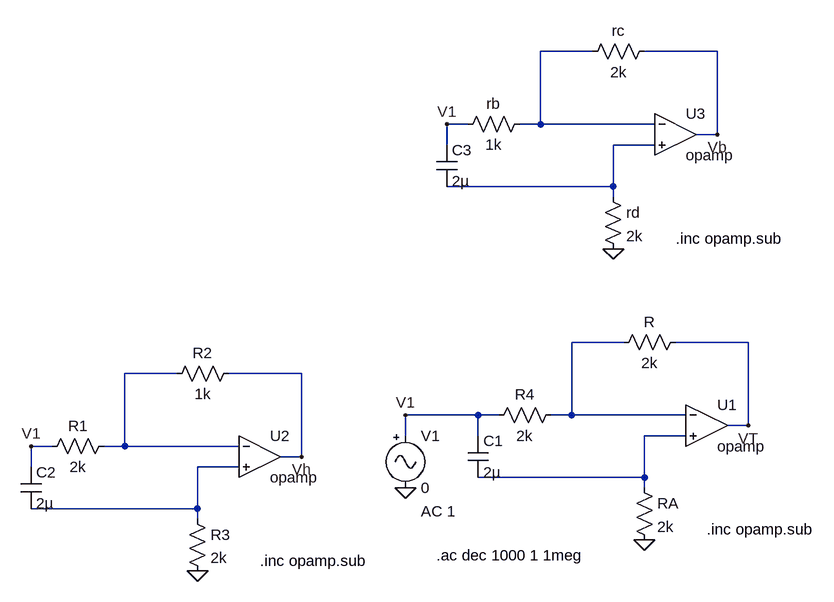
[diagram p0: schematic TS1.asc]
TS1.asc, the LTspice schematic file:
Version 4
SHEET 1 880 680
WIRE 224 -448 144 -448
WIRE 416 -448 304 -448
WIRE 32 -336 0 -336
WIRE 144 -336 144 -448
WIRE 144 -336 112 -336
WIRE 320 -336 144 -336
WIRE 416 -320 416 -448
WIRE 416 -320 384 -320
WIRE 0 -304 0 -336
WIRE 320 -304 256 -304
WIRE 256 -240 256 -304
WIRE 256 -240 0 -240
WIRE 256 -224 256 -240
WIRE 272 0 192 0
WIRE 464 0 352 0
WIRE -416 48 -496 48
WIRE -224 48 -336 48
WIRE 48 112 -64 112
WIRE 80 112 48 112
WIRE 192 112 192 0
WIRE 192 112 160 112
WIRE 368 112 192 112
WIRE 464 128 464 0
WIRE 464 128 432 128
WIRE -64 144 -64 112
WIRE 48 144 48 112
WIRE 368 144 304 144
WIRE -608 160 -640 160
WIRE -496 160 -496 48
WIRE -496 160 -528 160
WIRE -320 160 -496 160
WIRE -224 176 -224 48
WIRE -224 176 -256 176
WIRE -640 192 -640 160
WIRE -320 192 -384 192
WIRE 304 208 304 144
WIRE 304 208 48 208
WIRE 304 224 304 208
WIRE -384 256 -384 192
WIRE -384 256 -640 256
WIRE -384 272 -384 256
FLAG 304 304 0
FLAG -64 224 0
FLAG -64 112 V1
FLAG -384 352 0
FLAG 256 -144 0
FLAG 0 -336 V1
FLAG -640 160 V1
FLAG 464 128 VT
FLAG -224 176 Vh
FLAG 416 -320 Vb
SYMBOL res 176 96 R90
WINDOW 0 0 56 VBottom 2
WINDOW 3 32 56 VTop 2
SYMATTR InstName R4
SYMATTR Value 2k
SYMBOL res 368 -16 R90
WINDOW 0 0 56 VBottom 2
WINDOW 3 32 56 VTop 2
SYMATTR InstName R
SYMATTR Value 2k
SYMBOL Misc\\signal -64 128 R0
WINDOW 123 24 132 Left 2
WINDOW 39 0 0 Left 2
SYMATTR Value2 AC 1
SYMATTR InstName V1
SYMATTR Value 0
SYMBOL Opamps\\opamp 400 64 R0
SYMATTR InstName U1
SYMBOL res 288 208 R0
SYMATTR InstName RA
SYMATTR Value 2k
SYMBOL cap 32 144 R0
SYMATTR InstName C1
SYMATTR Value 2µ
SYMBOL res -512 144 R90
WINDOW 0 0 56 VBottom 2
WINDOW 3 32 56 VTop 2
SYMATTR InstName R1
SYMATTR Value 2k
SYMBOL res -320 32 R90
WINDOW 0 0 56 VBottom 2
WINDOW 3 32 56 VTop 2
SYMATTR InstName R2
SYMATTR Value 1k
SYMBOL Opamps\\opamp -288 112 R0
SYMATTR InstName U2
SYMBOL res -400 256 R0
SYMATTR InstName R3
SYMATTR Value 2k
SYMBOL cap -656 192 R0
SYMATTR InstName C2
SYMATTR Value 2µ
SYMBOL res 128 -352 R90
WINDOW 0 0 56 VBottom 2
WINDOW 3 32 56 VTop 2
SYMATTR InstName rb
SYMATTR Value 1k
SYMBOL res 320 -464 R90
WINDOW 0 0 56 VBottom 2
WINDOW 3 32 56 VTop 2
SYMATTR InstName rc
SYMATTR Value 2k
SYMBOL Opamps\\opamp 352 -384 R0
SYMATTR InstName U3
SYMBOL res 240 -240 R0
SYMATTR InstName rd
SYMATTR Value 2k
SYMBOL cap -16 -304 R0
SYMATTR InstName C3
SYMATTR Value 2µ
TEXT -16 328 Left 2 !.ac dec 1000 1 1meg
TEXT 400 288 Left 2 !.inc opamp.sub
TEXT -288 336 Left 2 !.inc opamp.sub
TEXT 352 -160 Left 2 !.inc opamp.sub

The netlist it stands for:
* TS1.asc
R4 N003 V1 2k
R VT N003 2k
V1 V1 0 0 AC 1
XU1 N003 N005 VT opamp Aol=100K GBW=10Meg  ; pins invin noninvin out
RA N005 0 2k
C1 V1 N005 2µ
R1 N004 V1 2k
R2 Vh N004 1k
XU2 N004 N006 Vh opamp Aol=100K GBW=10Meg  ; pins invin noninvin out
R3 N006 0 2k
C2 V1 N006 2µ
rb N001 V1 1k
rc Vb N001 2k
XU3 N001 N002 Vb opamp Aol=100K GBW=10Meg  ; pins invin noninvin out
rd N002 0 2k
C3 V1 N002 2µ
.ac dec 1000 1 1meg
.inc opamp.sub
.inc opamp.sub
.inc opamp.sub
.backanno
.end